# EAGLE design Mini Project Tx (EAGLE 7.4.0)
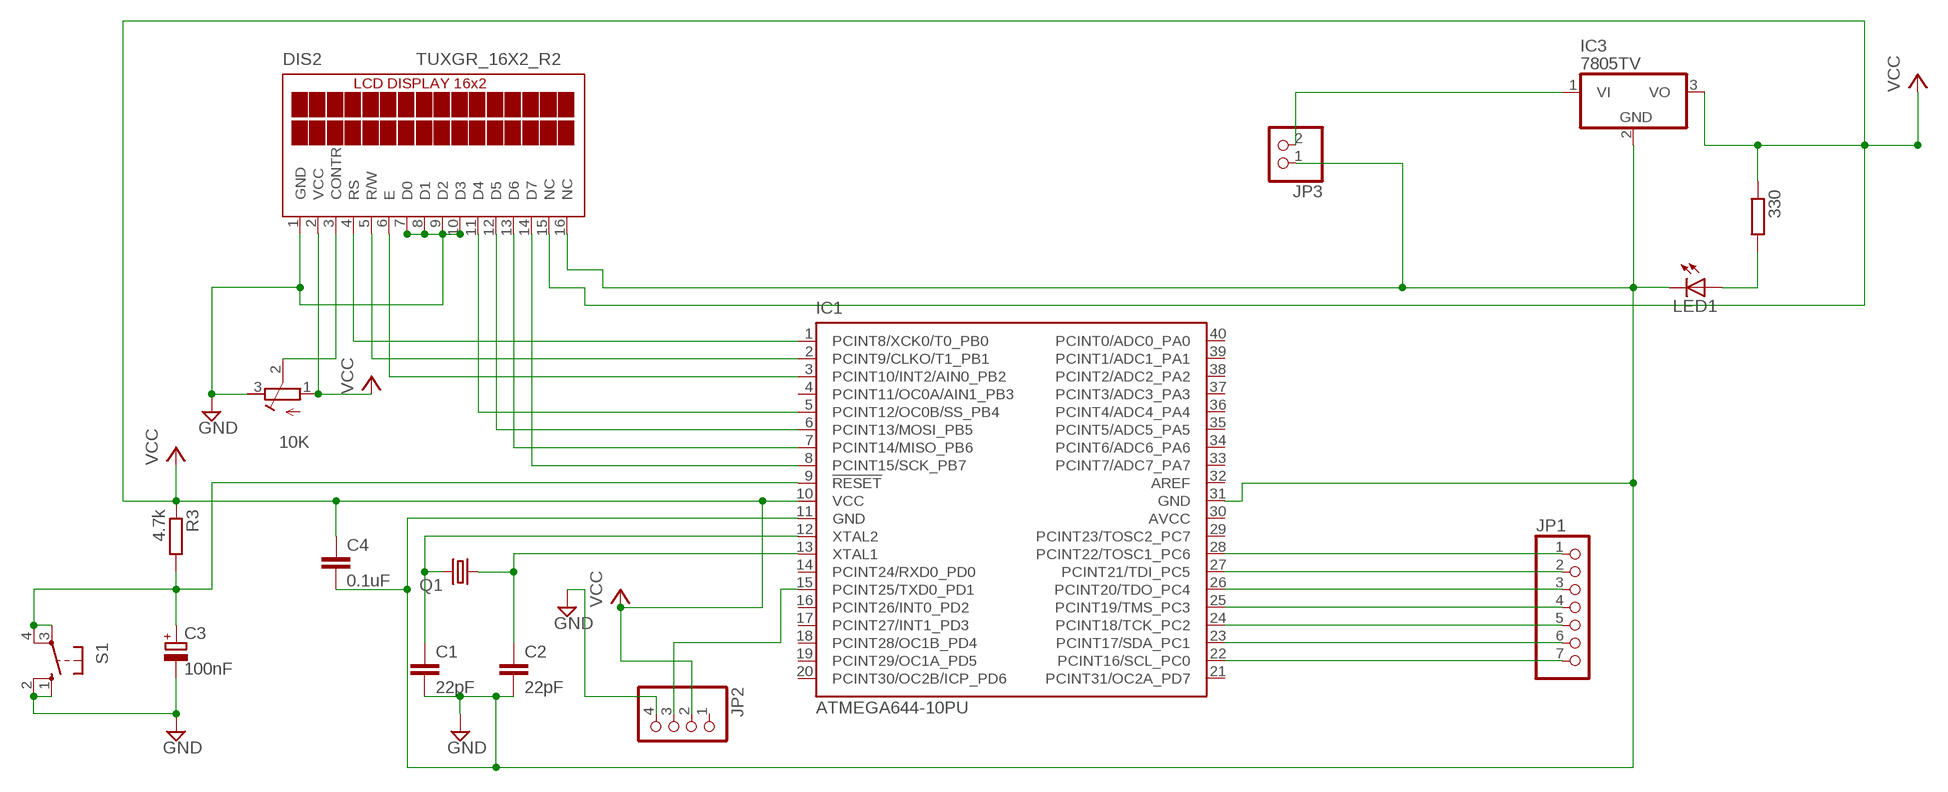
[diagram p0: schematic, sheet 1]

## Parts
10K  R-TRIMM64W  [RTRIM64W]
330  R-EU_0207/10  [0207/10]
C1  22pF  C-EU025-025X050  [C025-025X050]
C2  22pF  C-EU025-025X050  [C025-025X050]
C3  100nF  CPOL-EUE2-4  [E2-4]
C4  0.1uF  C-EU025-025X050  [C025-025X050]
DIS2  TUXGR_16X2_R2  [TUXGR_16X2_R2]
IC1  ATMEGA644-10PU  [DIL40]
IC3  7805TV  [TO220V]
JP1  PINHD-1X7  [1X07]
JP2  PINHD-1X4  [1X04]
JP3  PINHD-1X2  [1X02]
LED1  LED3MM  [LED3MM]
Q1  CRYSTALHC49S  [HC49/S]
R3  4.7k  R-EU_0207/10  [0207/10]
S1  10-XX  [B3F-10XX]

## Nets
9V: IC3.1(VI) JP3.2
GND: 10K.3(E) C1.2 C2.2 C3.- C4.2 DIS2.1(GND) DIS2.7(D0) DIS2.8(D1) DIS2.9(D2) DIS2.10(D3) DIS2.16(NC) IC1.11(GND) IC1.31(GND) IC3.2(GND) JP2.4 JP3.1 LED1.K(C) S1.1(S) S1.2(S1)
N$1: DIS2.4(RS) IC1.1(PCINT8/XCK0/T0_PB0)
N$2: DIS2.5(R/W) IC1.2(PCINT9/CLKO/T1_PB1)
N$3: DIS2.6(E) IC1.3(PCINT10/INT2/AIN0_PB2)
N$4: DIS2.11(D4) IC1.5(PCINT12/OC0B/SS_PB4)
N$5: DIS2.12(D5) IC1.6(PCINT13/MOSI_PB5)
N$6: DIS2.13(D6) IC1.7(PCINT14/MISO_PB6)
N$7: DIS2.14(D7) IC1.8(PCINT15/SCK_PB7)
N$8: IC1.22(PCINT16/SCL_PC0) JP1.7
N$9: IC1.23(PCINT17/SDA_PC1) JP1.6
N$10: IC1.24(PCINT18/TCK_PC2) JP1.5
N$11: IC1.25(PCINT19/TMS_PC3) JP1.4
N$12: IC1.26(PCINT20/TDO_PC4) JP1.3
N$13: IC1.27(PCINT21/TDI_PC5) JP1.2
N$14: IC1.28(PCINT22/TOSC1_PC6) JP1.1
N$15: IC1.15(PCINT25/TXD0_PD1) JP2.3
N$17: C1.1 IC1.12(XTAL2) Q1.2
N$18: 10K.2(S) DIS2.3(CONTR)
N$19: C2.1 IC1.13(XTAL1) Q1.1
N$21: 330.2 LED1.A
N$23: C3.+ IC1.9(!RESET) R3.2 S1.3(P) S1.4(P1)
VCC: 10K.1(A) 330.1 C4.1 DIS2.2(VCC) DIS2.15(NC) IC1.10(VCC) IC3.3(VO) JP2.2 R3.1
Unconnected: IC1.4(PCINT11/OC0A/AIN1_PB3) IC1.14(PCINT24/RXD0_PD0) IC1.16(PCINT26/INT0_PD2) IC1.17(PCINT27/INT1_PD3) IC1.18(PCINT28/OC1B_PD4) IC1.19(PCINT29/OC1A_PD5) IC1.20(PCINT30/OC2B/ICP_PD6) IC1.21(PCINT31/OC2A_PD7) IC1.29(PCINT23/TOSC2_PC7) IC1.32(AREF) IC1.33(PCINT7/ADC7_PA7) IC1.34(PCINT6/ADC6_PA6) IC1.35(PCINT5/ADC5_PA5) IC1.36(PCINT4/ADC4_PA4) IC1.37(PCINT3/ADC3_PA3) IC1.38(PCINT2/ADC2_PA2) IC1.39(PCINT1/ADC1_PA1) IC1.40(PCINT0/ADC0_PA0) JP2.1

## Power pins joined to a net without a drawn wire
AVCC: IC1.30(AVCC)

## Library data of the parts
10K = resistor:R-TRIMM: Trimm resistor
330 R3 = resistor:R-EU_: RESISTOR, European symbol
C1 C2 C4 = resistor:C-EU: CAPACITOR, European symbol
C3 = resistor:CPOL-EU: POLARIZED CAPACITOR, European symbol
DIS2 = display-lcd:TUXGR_16X2_R2: Tuxgraphics LCD display 16x2 characters reflective, without background light Source: tuxgr_12x2_r2.pdf; OC_FARNELL: unknown; OC_NEWARK: unknown
IC1 = atmel:ATMEGA644-*PU: 8-bit Microcontroller with 64K Bytes In-System Programmable Flash Auto generated by make-symbol-device-package-bsdl.ulp Rev. 34 Source: http://www.atmel.com/dyn/resources/prod_documents/doc2593.pdf; MPN: ATMEGA644V-10PU; OC_FARNELL: 1288342; OC_NEWARK: 23M5062
IC3 = linear:78*: Positive VOLTAGE REGULATOR Source: http://cache.national.com/ds/LM/LM78L05.pdf http://www.fairchildsemi.com/ds/LM/LM7805.pdf
JP1 = pinhead:PINHD-1X7: PIN HEADER
JP2 = pinhead:PINHD-1X4: PIN HEADER
JP3 = pinhead:PINHD-1X2: PIN HEADER
LED1 = led:LED: LED OSRAM: - CHIPLED LG R971, LG N971, LY N971, LG Q971, LY Q971, LO R971, LY R971 LH N974, LH R974 LS Q976, LO Q976, LY Q976 LO Q996 - Hyper CHIPLED LW Q18S LB Q993, LB Q99A, LB R99A - SideLED LS A670, LO A670, LY A670, LG A670, LP A670 LB A673, LV A673, LT A673, LW A673 LH A674 LY A675 LS A676, LA A676, LO A676, LY A676, LW A676 LS A679, LY A679, LG A679 - Hyper Micro SIDELED® LS Y876, LA Y876, LO Y876, LY Y876 LT Y87S - SmartLED LW L88C, LW L88S LB L89C, LB L89S, LG L890 LS L89K, LO L89K, LY L89K LS L896, LA L896, LO L896, LY L896 - TOPLED LS T670, LO T670, LY T670, LG T670, LP T670 LSG T670, LSP T670, LSY T670, LOP T670, LYG T670 LG T671, LOG T671, LSG T671 LB T673, LV T673, LT T673, LW T673 LH T674 LS T676, LA T676, LO T676, LY T676, LB T676, LH T676, LSB T676, LW T676 LB T67C, LV T67C, LT T67C, LS T67K, LO T67K, LY T67K, LW E67C LS E67B, LA E67B, LO E67B, LY E67B, LB E67C, LV E67C, LT E67C LW T67C LS T679, LY T679, LG T679 LS T770, LO T770, LY T770, LG T770, LP T770 LB T773, LV T773, LT T773, LW T773 LH T774 LS E675, LA E675, LY E675, LS T675 LS T776, LA T776, LO T776, LY T776, LB T776 LHGB T686 LT T68C, LB T68C - Hyper Mini TOPLED® LB M676 - Mini TOPLED Santana® LG M470 LS M47K, LO M47K, LY M47K Source: http://www.osram.convergy.de LUXEON: - LUMILED® LXK2-PW12-R00, LXK2-PW12-S00, LXK2-PW14-U00, LXK2-PW14-V00 LXK2-PM12-R00, LXK2-PM12-S00, LXK2-PM14-U00 LXK2-PE12-Q00, LXK2-PE12-R00, LXK2-PE12-S00, LXK2-PE14-T00, LXK2-PE14-U00 LXK2-PB12-K00, LXK2-PB12-L00, LXK2-PB12-M00, LXK2-PB14-N00, LXK2-PB14-P00, LXK2-PB14-Q00 LXK2-PR12-L00, LXK2-PR12-M00, LXK2-PR14-Q00, LXK2-PR14-R00 LXK2-PD12-Q00, LXK2-PD12-R00, LXK2-PD12-S00 LXK2-PH12-R00, LXK2-PH12-S00 LXK2-PL12-P00, LXK2-PL12-Q00, LXK2-PL12-R00 Source: www.luxeon.com KINGBRIGHT: KA-3528ASYC Source: www.kingbright.com
Q1 = crystal:CRYSTAL: CRYSTAL; OC_FARNELL: 1667008; OC_NEWARK: unknown
S1 = switch-omron:10-XX: OMRON SWITCH; MPN: B3F-1000; OC_FARNELL: 176432; OC_NEWARK: 36M3542

## Board
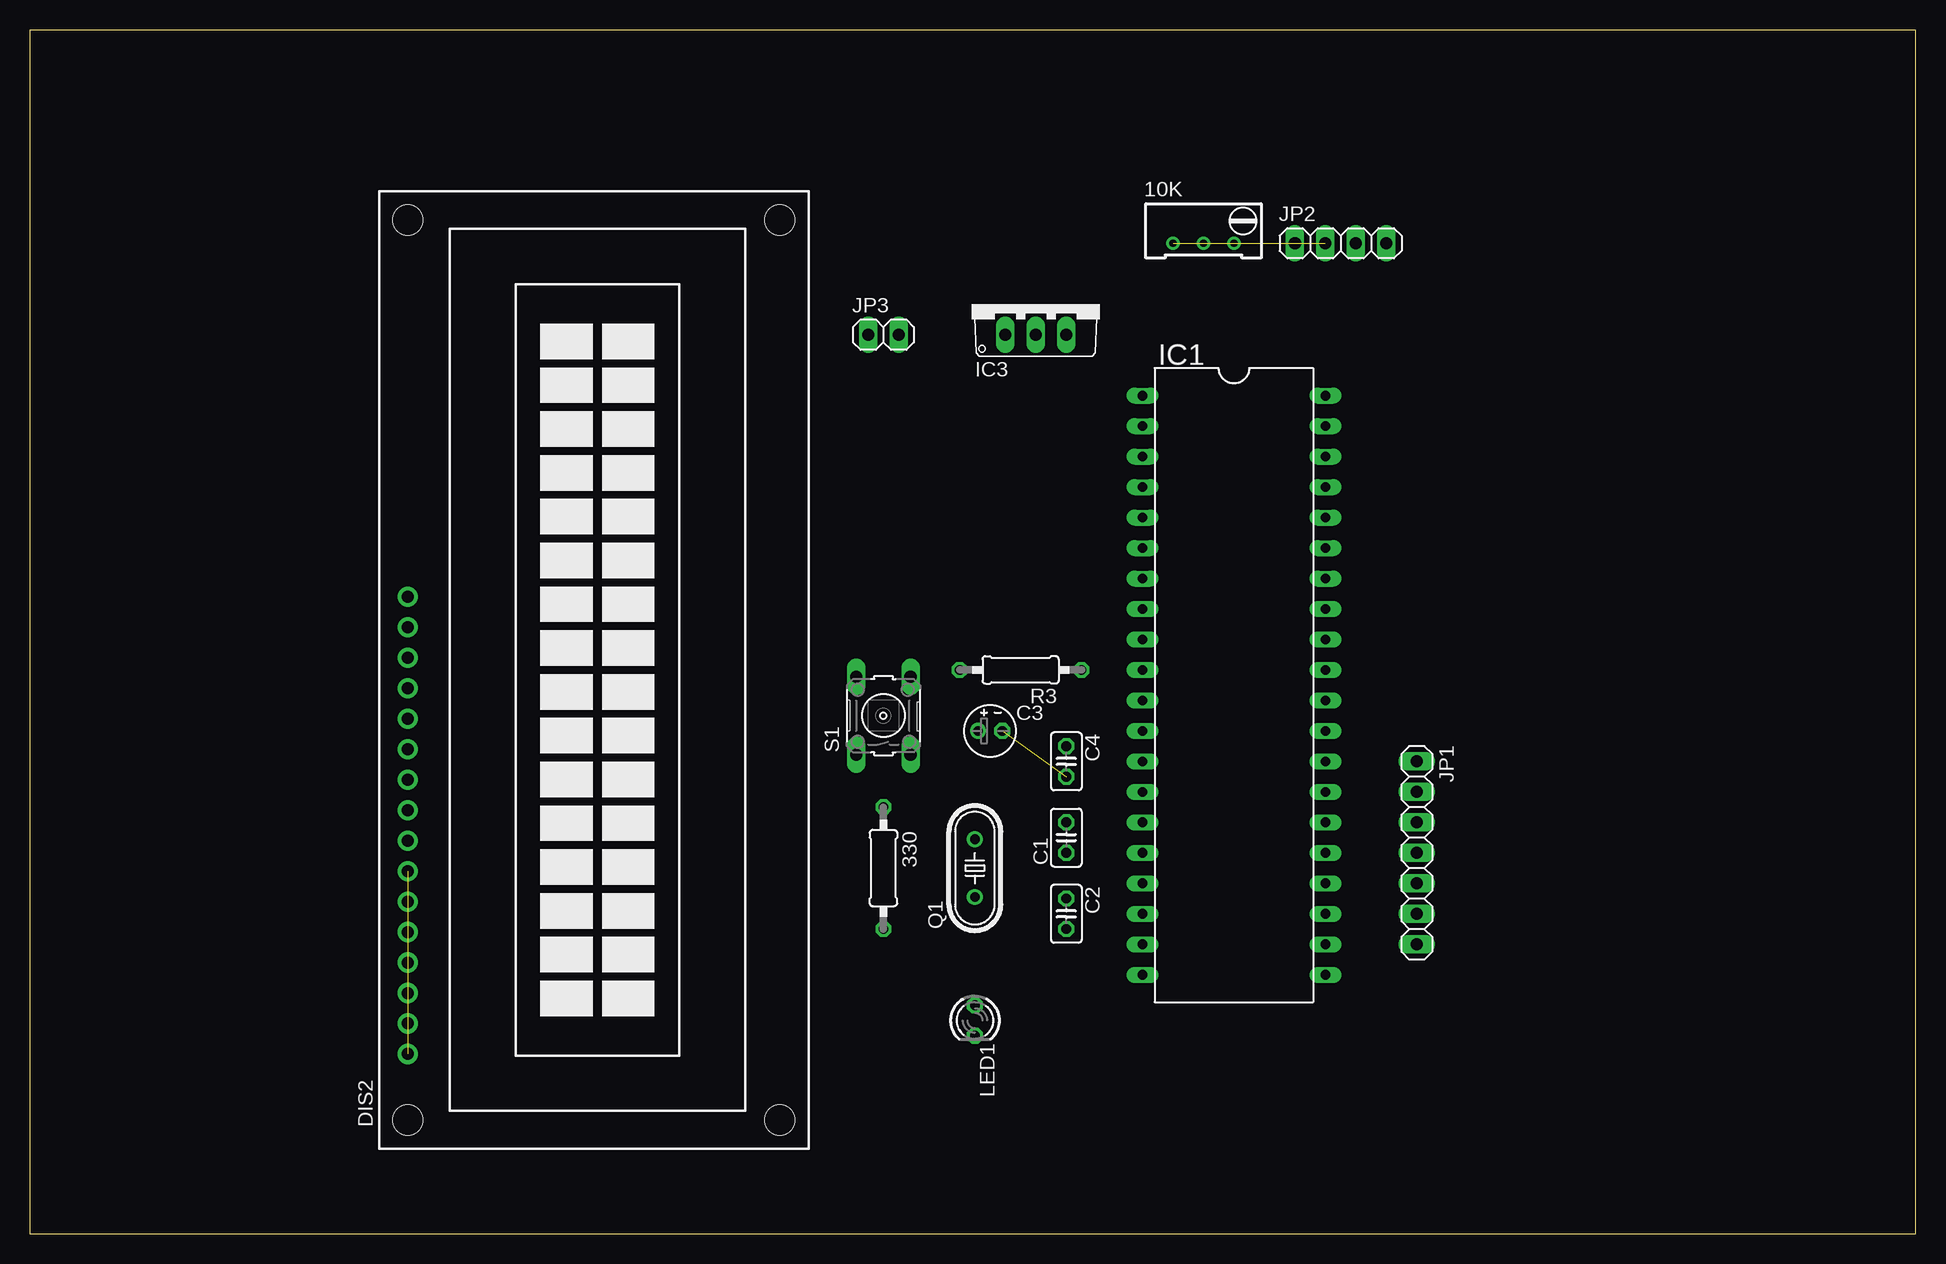
[diagram p1: board, top side]
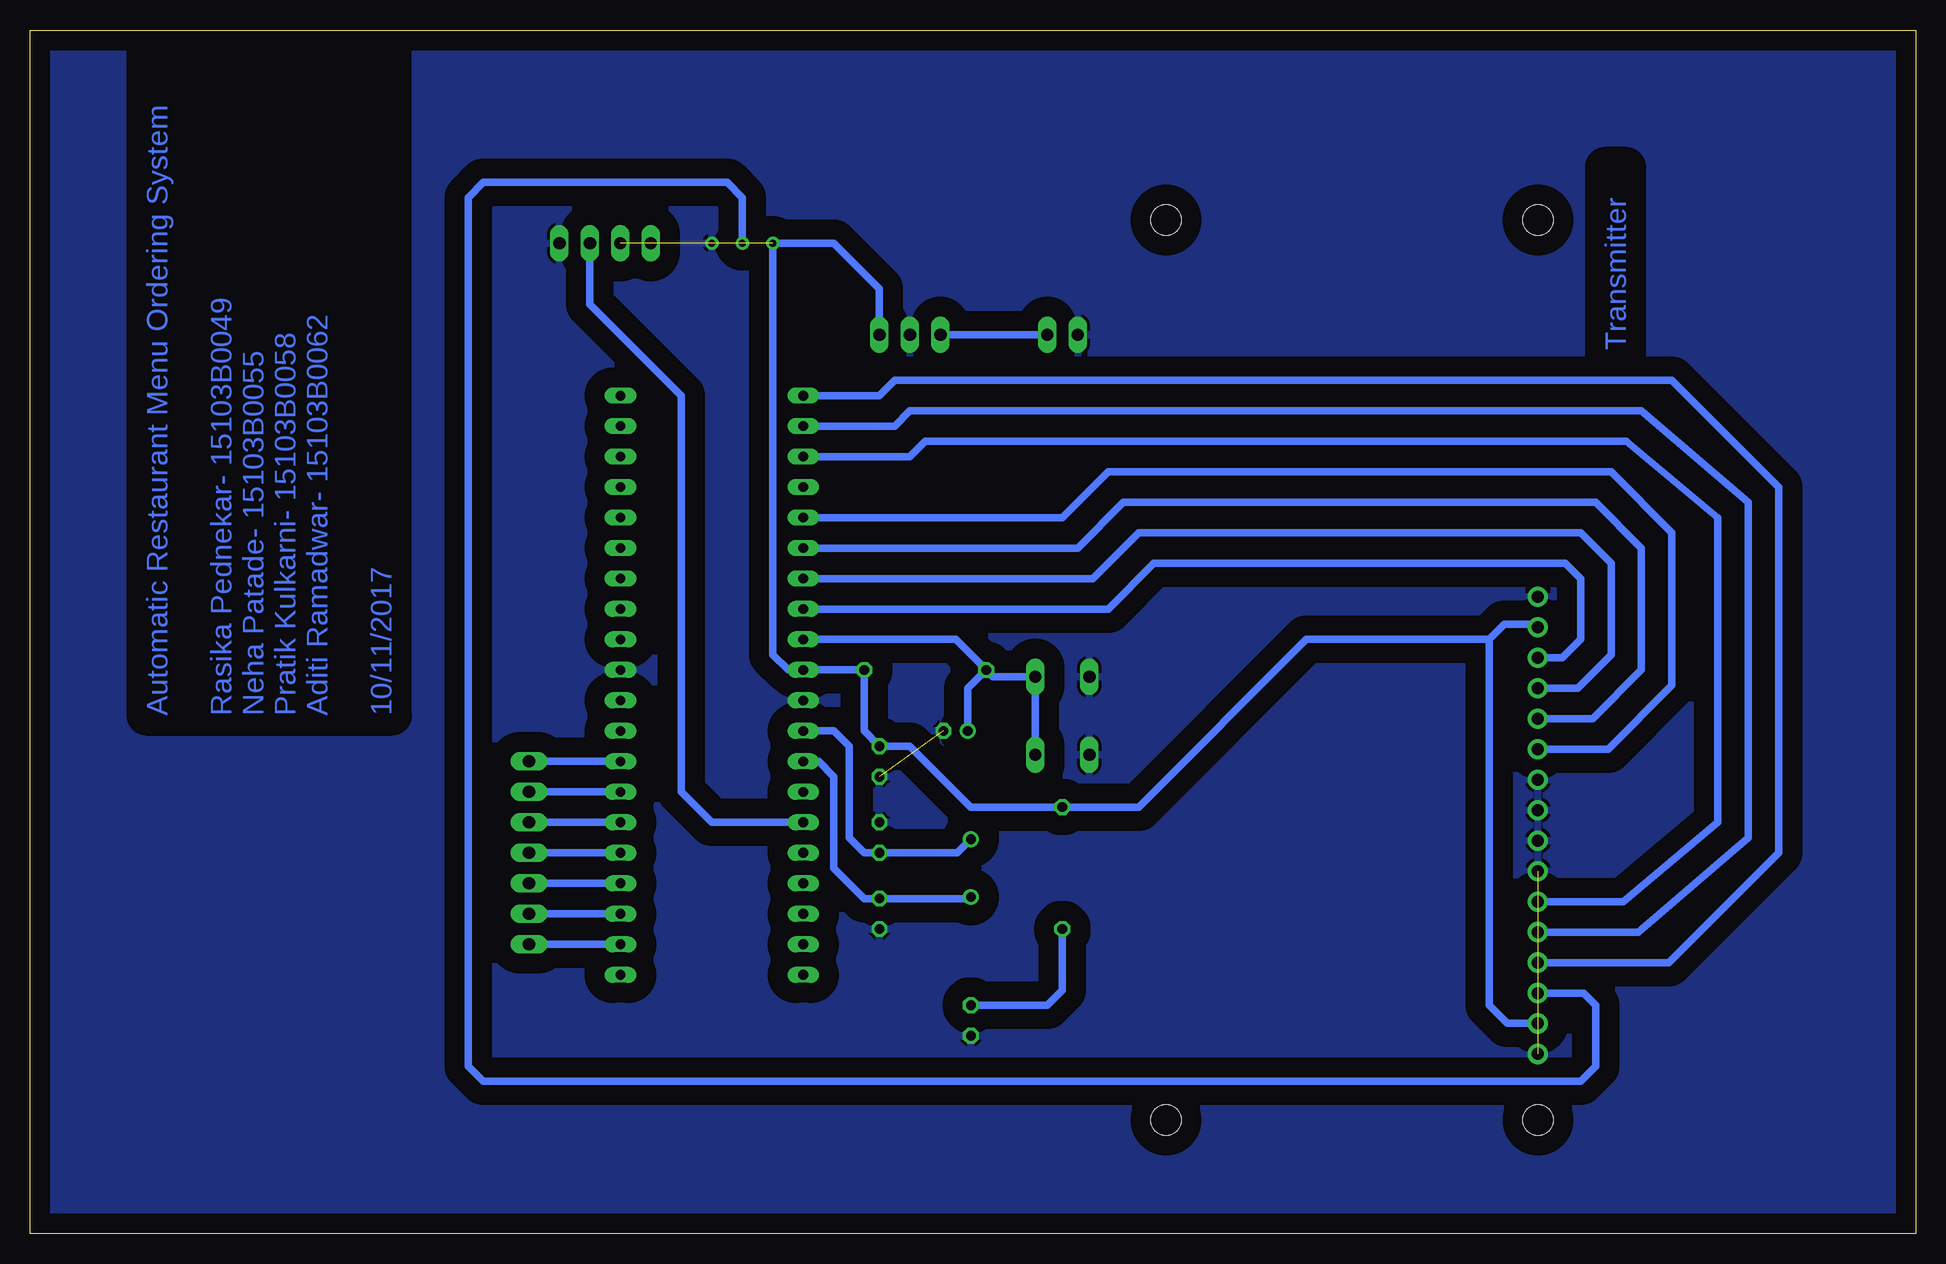
[diagram p2: board, bottom side, seen from below]

Size 157.15 x 100.32 mm. Coordinates in mm from the lower left corner, seen from the top.
Outline: 0,0 157.15,0 157.15,100.32 0,100.32 0,0
Copper layers (1*16): Top 0.035mm / dielectric 1.5mm / Bottom 0.035mm
Design rules "default": minimum track width 10mil, minimum drill 24mil, track to track 8mil, track to pad 8mil, pad to pad 8mil, via to via 8mil, smd to smd 8mil, copper to edge 40mil, drill to drill 8mil, minimum pad ring 10mil, minimum via ring 8mil, stop-mask expansion 4mil, vias tented up to drill 0mil, thermal gap 10mil

### Footprints (pad centres in the part's own frame; a part is rotated, then mirrored left to right if it is on the bottom)
RTRIM64W = drill 0.61: 1 1.27,-2.54; 2 1.27,0; 3 1.27,2.54
0207/10 = drill 0.813 octagon: 1 -5.08,0; 2 5.08,0
C025-025X050 = drill 0.813 octagon: 1 -1.27,0; 2 1.27,0
E2-4 = drill 0.813 pad 1.27: + -1.016,0 | drill 0.813 pad 1.27 octagon: - 1.016,0
TUXGR_16X2_R2 = drill 1 pad 1.676: 1 -32,15.5; 2 -29.46,15.5; 3 -26.92,15.5; 4 -24.38,15.5; 5 -21.84,15.5; 6 -19.3,15.5; 7 -16.76,15.5; 8 -14.22,15.5; 9 -11.68,15.5; 10 -9.14,15.5; 11 -6.6,15.5; 12 -4.06,15.5; 13 -1.52,15.5; 14 1.02,15.5; 15 3.56,15.5; 16 6.1,15.5 | hole 2.5: -37.5,-15.5; 37.5,-15.5; -37.5,15.5; 37.5,15.5
DIL40 = drill 0.813 long: 1 -24.13,-7.62; 2 -21.59,-7.62; 3 -19.05,-7.62; 4 -16.51,-7.62; 5 -13.97,-7.62; 6 -11.43,-7.62; 7 -8.89,-7.62; 8 -6.35,-7.62; 9 -3.81,-7.62; 10 -1.27,-7.62; 11 1.27,-7.62; 12 3.81,-7.62; 13 6.35,-7.62; 14 8.89,-7.62; 15 11.43,-7.62; 16 13.97,-7.62; 17 16.51,-7.62; 18 19.05,-7.62; 19 21.59,-7.62; 20 24.13,-7.62; 21 24.13,7.62; 22 21.59,7.62; 23 19.05,7.62; 24 16.51,7.62; 25 13.97,7.62; 26 11.43,7.62; 27 8.89,7.62; 28 6.35,7.62; 29 3.81,7.62; 30 1.27,7.62; 31 -1.27,7.62; 32 -3.81,7.62; 33 -6.35,7.62; 34 -8.89,7.62; 35 -11.43,7.62; 36 -13.97,7.62; 37 -16.51,7.62; 38 -19.05,7.62; 39 -21.59,7.62; 40 -24.13,7.62
TO220V = drill 1.016 long: 1 -2.54,-2.54; 2 0,-2.54; 3 2.54,-2.54
1X07 = drill 1.016 long: 1 -7.62,0; 2 -5.08,0; 3 -2.54,0; 4 0,0; 5 2.54,0; 6 5.08,0; 7 7.62,0
1X04 = drill 1.016 long: 1 -3.81,0; 2 -1.27,0; 3 1.27,0; 4 3.81,0
1X02 = drill 1.016 long: 1 -1.27,0; 2 1.27,0
LED3MM = drill 0.813 octagon: A -1.27,0; K 1.27,0
HC49/S = drill 0.813: 1 -2.413,0; 2 2.413,0
B3F-10XX = drill 1.016 long: 1 -3.251,2.261; 2 3.251,2.261; 3 -3.251,-2.261; 4 3.251,-2.261

### Placement (x,y rotation side)
10K  97.79,83.82 270 top
330  71.12,30.48 270 top
C1  86.36,33.02 90 top
C2  86.36,26.67 270 top
C3  80.01,41.91 0 top
C4  86.36,39.37 270 top
DIS2  46.99,46.99 90 top
IC1  100.33,45.72 270 top
IC3  83.82,77.47 0 top
JP1  115.57,31.75 270 top
JP2  109.22,82.55 0 top
JP3  71.12,74.93 0 top
LED1  78.74,17.78 270 top
Q1  78.74,30.48 90 top
R3  82.55,46.99 180 top
S1  71.12,43.18 90 top

### Tracks (layer width: path | path; a pad name or v marks a point on that pad's centre or on a via)
9V
  Bottom 0.61: JP3.2 IC3.1
GND  (2 unrouted)
  pour Bottom (isolate 1.676): 0,100.33 157.48,100.33 157.48,0 0,0
N$1
  Bottom 0.61: DIS2.4 20.57,22.61 11.43,31.75 11.43,62.23 20.32,71.12 85.09,71.12 86.36,69.85 IC1.1
N$2
  Bottom 0.61: DIS2.5 23.11,25.15 13.97,33.02 13.97,60.96 22.86,68.58 83.82,68.58 85.09,67.31 IC1.2
N$3
  Bottom 0.61: DIS2.6 24.38,27.69 16.51,34.29 16.51,59.69 24.13,66.04 82.55,66.04 83.82,64.77 IC1.3
N$4
  Bottom 0.61: DIS2.11 25.65,40.39 20.32,45.72 20.32,58.42 25.4,63.5 67.31,63.5 71.12,59.69 IC1.5
N$5
  Bottom 0.61: DIS2.12 26.92,42.93 22.86,46.99 22.86,57.15 26.67,60.96 66.04,60.96 69.85,57.15 IC1.6
N$6
  Bottom 0.61: DIS2.13 28.19,45.47 25.4,48.26 25.4,55.88 27.94,58.42 64.77,58.42 68.58,54.61 IC1.7
N$7
  Bottom 0.61: DIS2.14 29.46,48.01 27.94,49.53 27.94,54.61 29.21,55.88 63.5,55.88 67.31,52.07 IC1.8
N$8
  Bottom 0.61: JP1.7 IC1.22
N$9
  Bottom 0.61: JP1.6 IC1.23
N$10
  Bottom 0.61: JP1.5 IC1.24
N$11
  Bottom 0.61: JP1.4 IC1.25
N$12
  Bottom 0.61: JP1.3 IC1.26
N$13
  Bottom 0.61: JP1.2 IC1.27
N$14
  Bottom 0.61: JP1.1 IC1.28
N$15
  Bottom 0.61: IC1.15 100.33,34.29 102.87,36.83 102.87,69.85 110.49,77.47 JP2.3
N$17
  Bottom 0.61: Q1.2 79.88,31.75 C1.1 87.63,31.75 88.9,33.02 88.9,40.64 90.17,41.91 IC1.12
N$18
  Bottom 0.61: DIS2.3 27.69,20.07 26.67,19.05 26.67,13.97 27.94,12.7 119.38,12.7 120.65,13.97 120.65,86.36 119.38,87.63 99.06,87.63 97.79,86.36 10K.2
N$19
  Bottom 0.61: Q1.1 78.87,27.94 C2.1 87.63,27.94 90.17,30.48 90.17,38.1 91.44,39.37 IC1.13
N$21
  Bottom 0.61: 330.2 71.12,20.32 72.39,19.05 LED1.A
N$23
  Bottom 0.61: S1.3 S1.4 76.91,46.43 R3.2 | C3.+ 78.99,45.47 R3.2 | IC1.9 80.01,49.53 R3.2
VCC  (1 unrouted)
  Bottom 0.61: DIS2.2 34.04,17.53 35.56,19.05 35.56,49.53 | 35.56,49.53 34.29,50.8 31.74,50.8 DIS2.15 | 35.56,49.53 50.8,49.53 64.77,35.56 330.1 78.74,35.56 83.82,40.64 C4.1 87.63,41.91 R3.1 IC1.10 93.98,46.99 95.25,48.26 10K.1 90.17,82.55 86.36,78.74 IC3.3

### Text on the board
Bottom: Transmitter | Automatic Restaurant Menu Ordering System / / Rasika Pednekar- 15103B0049 / Neha Patade- 15103B0055 / Pratik Kulkarni- 15103B0058 / Aditi Ramadwar- 15103B0062 / / 10/11/2017